# EAGLE schematic sdmapper (EAGLE 6.3)
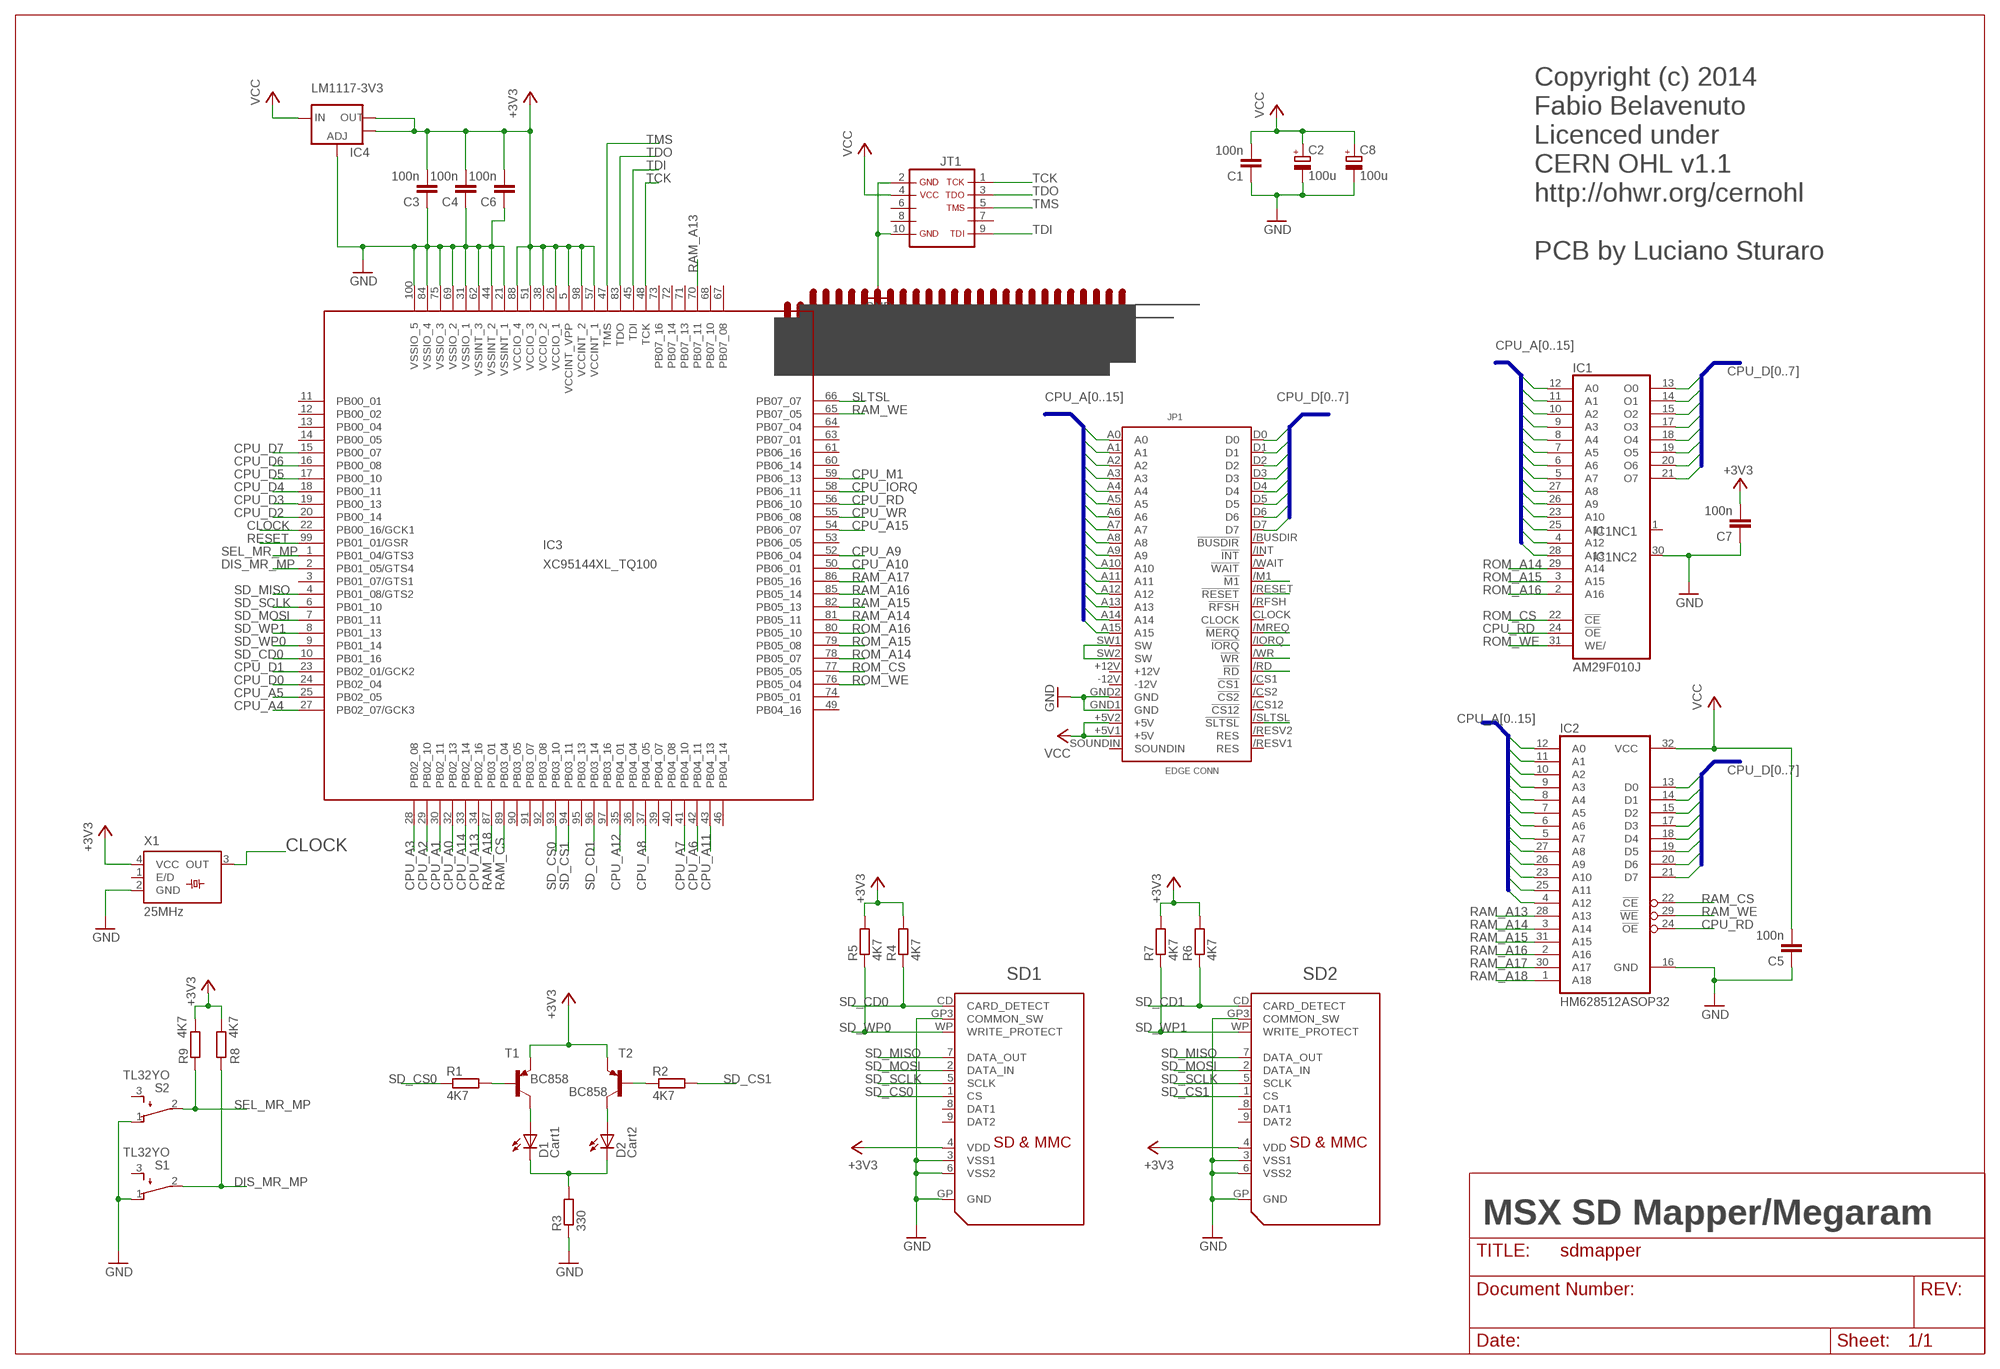
[diagram p0: schematic, sheet 1]

## Parts
C1  100n  C-EUC0805  [C0805]
C2  100u  CPOL-EUE3.5-8  [E3,5-8]
C3  100n  C-EUC0805  [C0805]
C4  100n  C-EUC0805  [C0805]
C5  100n  C-EUC0805  [C0805]
C6  100n  C-EUC1206  [C1206]
C7  100n  C-EUC1206  [C1206]
C8  100u  CPOL-EUC  [PANASONIC_C]
D1  Cart1  LED3MM  [LED3MM]
D2  Cart2  LED3MM  [LED3MM]
IC1  AM29F010J  [PLCC32R]
IC2  HM628512ASOP32  [SOP32]
IC3  XC95144XL_TQ100  [XC-TQ100]
IC4  LM1117-3V3  V_REG_LM1117SOT223  [SOT223]
JP1  MSXCART1  [MSXCART]
JT1  JTAG1B  [SMD5X2]
R1  4K7  R-EU_R0805  [R0805]
R2  4K7  R-EU_R0805  [R0805]
R3  330  R-EU_R0805  [R0805]
R4  4K7  R-EU_R0805  [R0805]
R5  4K7  R-EU_R0805  [R0805]
R6  4K7  R-EU_R0805  [R0805]
R7  4K7  R-EU_R0805  [R0805]
R8  4K7  R-EU_R0805  [R0805]
R9  4K7  R-EU_R0805  [R0805]
S1  TL32YO  [TL3XYO]
S2  TL32YO  [TL3XYO]
SD1  SDMMC06132  [06132]
SD2  SDMMC06132  [06132]
T1  BC858  BC858A-PNP-SOT23-BEC  [SOT23-BEC]
T2  BC858  BC858A-PNP-SOT23-BEC  [SOT23-BEC]
X1  25MHz  SM77H  [SM77H]

## Nets
+3V3 [power]: C3.2 C4.2 C6.2 C7.2 IC3.5(VCCINT_VPP) IC3.26(VCCIO_1) IC3.38(VCCIO_2) IC3.51(VCCIO_3) IC3.57(VCCINT_1) IC3.88(VCCIO_4) IC3.98(VCCINT_2) IC4.2(OUT) IC4.4(OUT) R4.2 R5.2 R6.2 R7.2 R8.2 R9.2 SD1.4(VDD) SD2.4(VDD) T1.E T2.E X1.4(VCC)
CLOCK: IC3.22(PB00_16/GCK1) X1.3(OUT)
CPU_A0: IC1.12(A0) IC2.12(A0) IC3.32(PB02_13) JP1.A0
CPU_A1: IC1.11(A1) IC2.11(A1) IC3.30(PB02_11) JP1.A1
CPU_A2: IC1.10(A2) IC2.10(A2) IC3.29(PB02_10) JP1.A2
CPU_A3: IC1.9(A3) IC2.9(A3) IC3.28(PB02_08) JP1.A3
CPU_A4: IC1.8(A4) IC2.8(A4) IC3.27(PB02_07/GCK3) JP1.A4
CPU_A5: IC1.7(A5) IC2.7(A5) IC3.25(PB02_05) JP1.A5
CPU_A6: IC1.6(A6) IC2.6(A6) IC3.42(PB04_11) JP1.A6
CPU_A7: IC1.5(A7) IC2.5(A7) IC3.41(PB04_10) JP1.A7
CPU_A8: IC1.27(A8) IC2.27(A8) IC3.37(PB04_05) JP1.A8
CPU_A9: IC1.26(A9) IC2.26(A9) IC3.52(PB06_04) JP1.A9
CPU_A10: IC1.23(A10) IC2.23(A10) IC3.50(PB06_01) JP1.A10
CPU_A11: IC1.25(A11) IC2.25(A11) IC3.43(PB04_13) JP1.A11
CPU_A12: IC1.4(A12) IC2.4(A12) IC3.35(PB04_01) JP1.A12
CPU_A13: IC1.28(A13) IC3.34(PB02_16) JP1.A13
CPU_A14: IC3.33(PB02_14) JP1.A14
CPU_A15: IC3.54(PB06_07) JP1.A15
CPU_D0: IC1.13(O0) IC2.13(D0) IC3.24(PB02_04) JP1.D0
CPU_D1: IC1.14(O1) IC2.14(D1) IC3.23(PB02_01/GCK2) JP1.D1
CPU_D2: IC1.15(O2) IC2.15(D2) IC3.20(PB00_14) JP1.D2
CPU_D3: IC1.17(O3) IC2.17(D3) IC3.19(PB00_13) JP1.D3
CPU_D4: IC1.18(O4) IC2.18(D4) IC3.18(PB00_11) JP1.D4
CPU_D5: IC1.19(O5) IC2.19(D5) IC3.17(PB00_10) JP1.D5
CPU_D6: IC1.20(O6) IC2.20(D6) IC3.16(PB00_08) JP1.D6
CPU_D7: IC1.21(O7) IC2.21(D7) IC3.15(PB00_07) JP1.D7
CPU_IORQ: IC3.58(PB06_11) JP1./IORQ(!IORQ)
CPU_M1: IC3.59(PB06_13) JP1./M1(!M1)
CPU_MREQ: JP1./MREQ(!MERQ)
CPU_RD: IC1.24(!OE) IC2.24(!OE) IC3.56(PB06_10) JP1./RD(!RD)
CPU_WR: IC3.55(PB06_08) JP1./WR(!WR)
DIS_MR_MP: IC3.2(PB01_05/GTS4) R8.1 S1.2(P)
GND [power]: C1.1 C2.- C3.1 C4.1 C5.1 C6.1 C7.1 C8.- IC1.30(NC) IC2.16(GND) IC3.21(VSSINT_1) IC3.31(VSSIO_1) IC3.44(VSSINT_2) IC3.62(VSSINT_3) IC3.69(VSSIO_2) IC3.75(VSSIO_3) IC3.84(VSSIO_4) IC3.100(VSSIO_5) IC4.1(ADJ) JP1.GND1(GND) JP1.GND2(GND) JT1.2 JT1.10 R3.1 S1.1(O) S2.1(O) SD1.3(VSS1) SD1.6(VSS2) SD1.GP3(COMMON_SW) SD1.GP(GND) SD2.3(VSS1) SD2.6(VSS2) SD2.GP3(COMMON_SW) SD2.GP(GND) X1.2(GND)
N$1: JP1.SW1(SW) JP1.SW2(SW)
N$4: R1.2 T1.B
N$5: R2.1 T2.B
N$7: D1.K(C) D2.K(C) R3.2
N$8: D1.A T1.C
N$9: D2.A T2.C
RAM_A13: IC2.28(A13) IC3.70(PB07_11)
RAM_A14: IC2.3(A14) IC3.81(PB05_11)
RAM_A15: IC2.31(A15) IC3.82(PB05_13)
RAM_A16: IC2.2(A16) IC3.85(PB05_14)
RAM_A17: IC2.30(A17) IC3.86(PB05_16)
RAM_A18: IC2.1(A18) IC3.87(PB03_01)
RAM_CS: IC2.22(!CE) IC3.89(PB03_04)
RAM_WE: IC2.29(!WE) IC3.65(PB07_05)
RESET: IC3.99(PB01_01/GSR) JP1./RESET(!RESET)
ROM_A14: IC1.29(A14) IC3.78(PB05_07)
ROM_A15: IC1.3(A15) IC3.79(PB05_08)
ROM_A16: IC1.2(A16) IC3.80(PB05_10)
ROM_CS: IC1.22(!CE) IC3.77(PB05_05)
ROM_WE: IC1.31(WE/) IC3.76(PB05_04)
SD_CD0: IC3.10(PB01_16) R4.1 SD1.CD(CARD_DETECT)
SD_CD1: IC3.96(PB03_14) R6.1 SD2.CD(CARD_DETECT)
SD_CS0: IC3.93(PB03_10) R1.1 SD1.1(CS)
SD_CS1: IC3.94(PB03_11) R2.2 SD2.1(CS)
SD_MISO: IC3.4(PB01_08/GTS2) SD1.7(DATA_OUT) SD2.7(DATA_OUT)
SD_MOSI: IC3.7(PB01_11) SD1.2(DATA_IN) SD2.2(DATA_IN)
SD_SCLK: IC3.6(PB01_10) SD1.5(SCLK) SD2.5(SCLK)
SD_WP0: IC3.9(PB01_14) R5.1 SD1.WP(WRITE_PROTECT)
SD_WP1: IC3.8(PB01_13) R7.1 SD2.WP(WRITE_PROTECT)
SEL_MR_MP: IC3.1(PB01_04/GTS3) R9.1 S2.2(P)
SLTSL: IC3.66(PB07_07) JP1./SLTSL(!SLTSL)
TCK: IC3.48(TCK) JT1.1
TDI: IC3.45(TDI) JT1.9
TDO: IC3.83(TDO) JT1.3
TMS: IC3.47(TMS) JT1.5
VCC [power]: C1.2 C2.+ C5.2 C8.+ IC2.32(VCC) IC4.3(IN) JP1.+5V1(+5V) JP1.+5V2(+5V) JT1.4
Unconnected: IC1.1(NC) IC3.3(PB01_07/GTS1) IC3.11(PB00_01) IC3.12(PB00_02) IC3.13(PB00_04) IC3.14(PB00_05) IC3.36(PB04_04) IC3.39(PB04_07) IC3.40(PB04_08) IC3.46(PB04_14) IC3.49(PB04_16) IC3.53(PB06_05) IC3.60(PB06_14) IC3.61(PB06_16) IC3.63(PB07_01) IC3.64(PB07_04) IC3.67(PB07_08) IC3.68(PB07_10) IC3.71(PB07_13) IC3.72(PB07_14) IC3.73(PB07_16) IC3.74(PB05_01) IC3.90(PB03_05) IC3.91(PB03_07) IC3.92(PB03_08) IC3.95(PB03_13) IC3.97(PB03_16) JP1.+12V JP1.-12V JP1./BUSDIR(!BUSDIR) JP1./CS1(!CS1) JP1./CS2(!CS2) JP1./CS12(!CS12) JP1./INT(!INT) JP1./RESV1(RES) JP1./RESV2(RES) JP1./RFSH(!RFSH) JP1./WAIT(!WAIT) JP1.CLOCK JP1.SOUNDIN JT1.6 JT1.7 JT1.8 S1.3(S) S2.3(S) SD1.8(DAT1) SD1.9(DAT2) SD2.8(DAT1) SD2.9(DAT2) X1.1(E/D)

## Buses
CPU_A[0..15]
CPU_D[0..7]

## Notes on the sheet
- Copyright (c) 2014
  Fabio Belavenuto
  Licenced under
  CERN OHL v1.1
  http://ohwr.org/cernohl
  
  PCB by Luciano Sturaro
- SD1 | SD2
- MSX SD Mapper/Megaram

## Power pins joined to a net without a drawn wire
GND: IC1.16(GND)
VCC: IC1.32(VCC)

## Library data of the parts
C1 C3-C7 = rcl:C-EU: CAPACITOR, European symbol
C2 C8 = rcl:CPOL-EU: POLARIZED CAPACITOR, European symbol
D1 D2 = led:LED: LED OSRAM: - CHIPLED LG R971, LG N971, LY N971, LG Q971, LY Q971, LO R971, LY R971 LH N974, LH R974 LS Q976, LO Q976, LY Q976 LO Q996 - Hyper CHIPLED LW Q18S LB Q993, LB Q99A, LB R99A - SideLED LS A670, LO A670, LY A670, LG A670, LP A670 LB A673, LV A673, LT A673, LW A673 LH A674 LY A675 LS A676, LA A676, LO A676, LY A676, LW A676 LS A679, LY A679, LG A679 - Hyper Micro SIDELED® LS Y876, LA Y876, LO Y876, LY Y876 LT Y87S - SmartLED LW L88C, LW L88S LB L89C, LB L89S, LG L890 LS L89K, LO L89K, LY L89K LS L896, LA L896, LO L896, LY L896 - TOPLED LS T670, LO T670, LY T670, LG T670, LP T670 LSG T670, LSP T670, LSY T670, LOP T670, LYG T670 LG T671, LOG T671, LSG T671 LB T673, LV T673, LT T673, LW T673 LH T674 LS T676, LA T676, LO T676, LY T676, LB T676, LH T676, LSB T676, LW T676 LB T67C, LV T67C, LT T67C, LS T67K, LO T67K, LY T67K, LW E67C LS E67B, LA E67B, LO E67B, LY E67B, LB E67C, LV E67C, LT E67C LW T67C LS T679, LY T679, LG T679 LS T770, LO T770, LY T770, LG T770, LP T770 LB T773, LV T773, LT T773, LW T773 LH T774 LS E675, LA E675, LY E675, LS T675 LS T776, LA T776, LO T776, LY T776, LB T776 LHGB T686 LT T68C, LB T68C - Hyper Mini TOPLED® LB M676 - Mini TOPLED Santana® LG M470 LS M47K, LO M47K, LY M47K Source: http://www.osram.convergy.de LUXEON: - LUMILED® LXK2-PW12-R00, LXK2-PW12-S00, LXK2-PW14-U00, LXK2-PW14-V00 LXK2-PM12-R00, LXK2-PM12-S00, LXK2-PM14-U00 LXK2-PE12-Q00, LXK2-PE12-R00, LXK2-PE12-S00, LXK2-PE14-T00, LXK2-PE14-U00 LXK2-PB12-K00, LXK2-PB12-L00, LXK2-PB12-M00, LXK2-PB14-N00, LXK2-PB14-P00, LXK2-PB14-Q00 LXK2-PR12-L00, LXK2-PR12-M00, LXK2-PR14-Q00, LXK2-PR14-R00 LXK2-PD12-Q00, LXK2-PD12-R00, LXK2-PD12-S00 LXK2-PH12-R00, LXK2-PH12-S00 LXK2-PL12-P00, LXK2-PL12-Q00, LXK2-PL12-R00 Source: www.luxeon.com KINGBRIGHT: KA-3528ASYC Source: www.kingbright.com
IC1 = am29-memory:AM29F010*: 1-Megabit FLASH MEMORY (128 K x 8 bit) 5 V-only
IC2 = hitachi_sram_hm628512a-series_rev1:HM628512A: 4M SRAM 512kword x 8bit
IC3 = XC:XC95144XL_TQ100: xc95144xl_tq100 edit this description Auto generated by make-symbol-device-package-bsdl.ulp Rev. 34 Source: xc95144xl_tq100.bsd
IC4 = SparkFun-PowerIC:V_REG_LM1117: Voltage Regulator LM1117 Standard adjustable voltage regulator but in SMD form. Spark Fun Electronics SKU : COM-00595
JP1 = msx-con:MSXCART
JT1 = JTAGs:JTAG1: PIN HEADER
R1-R9 = rcl:R-EU_: RESISTOR, European symbol
S1 S2 = switch:TL32YO: TINY SWITCH ON - MOM Source: http://www2.produktinfo.conrad.com/datenblaetter/700000-724999/705152-da-01-de-Subminiaturschalter_TL_36YO.pdf
SD1 SD2 = adafruit:SDMMC: SD MMC Card holder 4UCON part #06132 - easy to solder
T1 T2 = transistor:*-PNP-: PNP Transistror
X1 = crystal:SM77H: 3.3V CMOS Clock Oscillator Source: www.pletronics.com .. sm77h%203.3v.pdf; OC_FARNELL: unknown; OC_NEWARK: unknown

## Net classes
0 default: width 0.254 mm, drill 0.5 mm
1 power: width 0.406 mm, drill 0.5 mm